# EasyEDA Pro project FPGC-CycloneIV-AIO.eprj, schematic Schematic1, sheet 4 of 4

## Sheets
4 IO: Create Date: 2025-10-29; Page Name: IO; Update Date: 2025-11-17
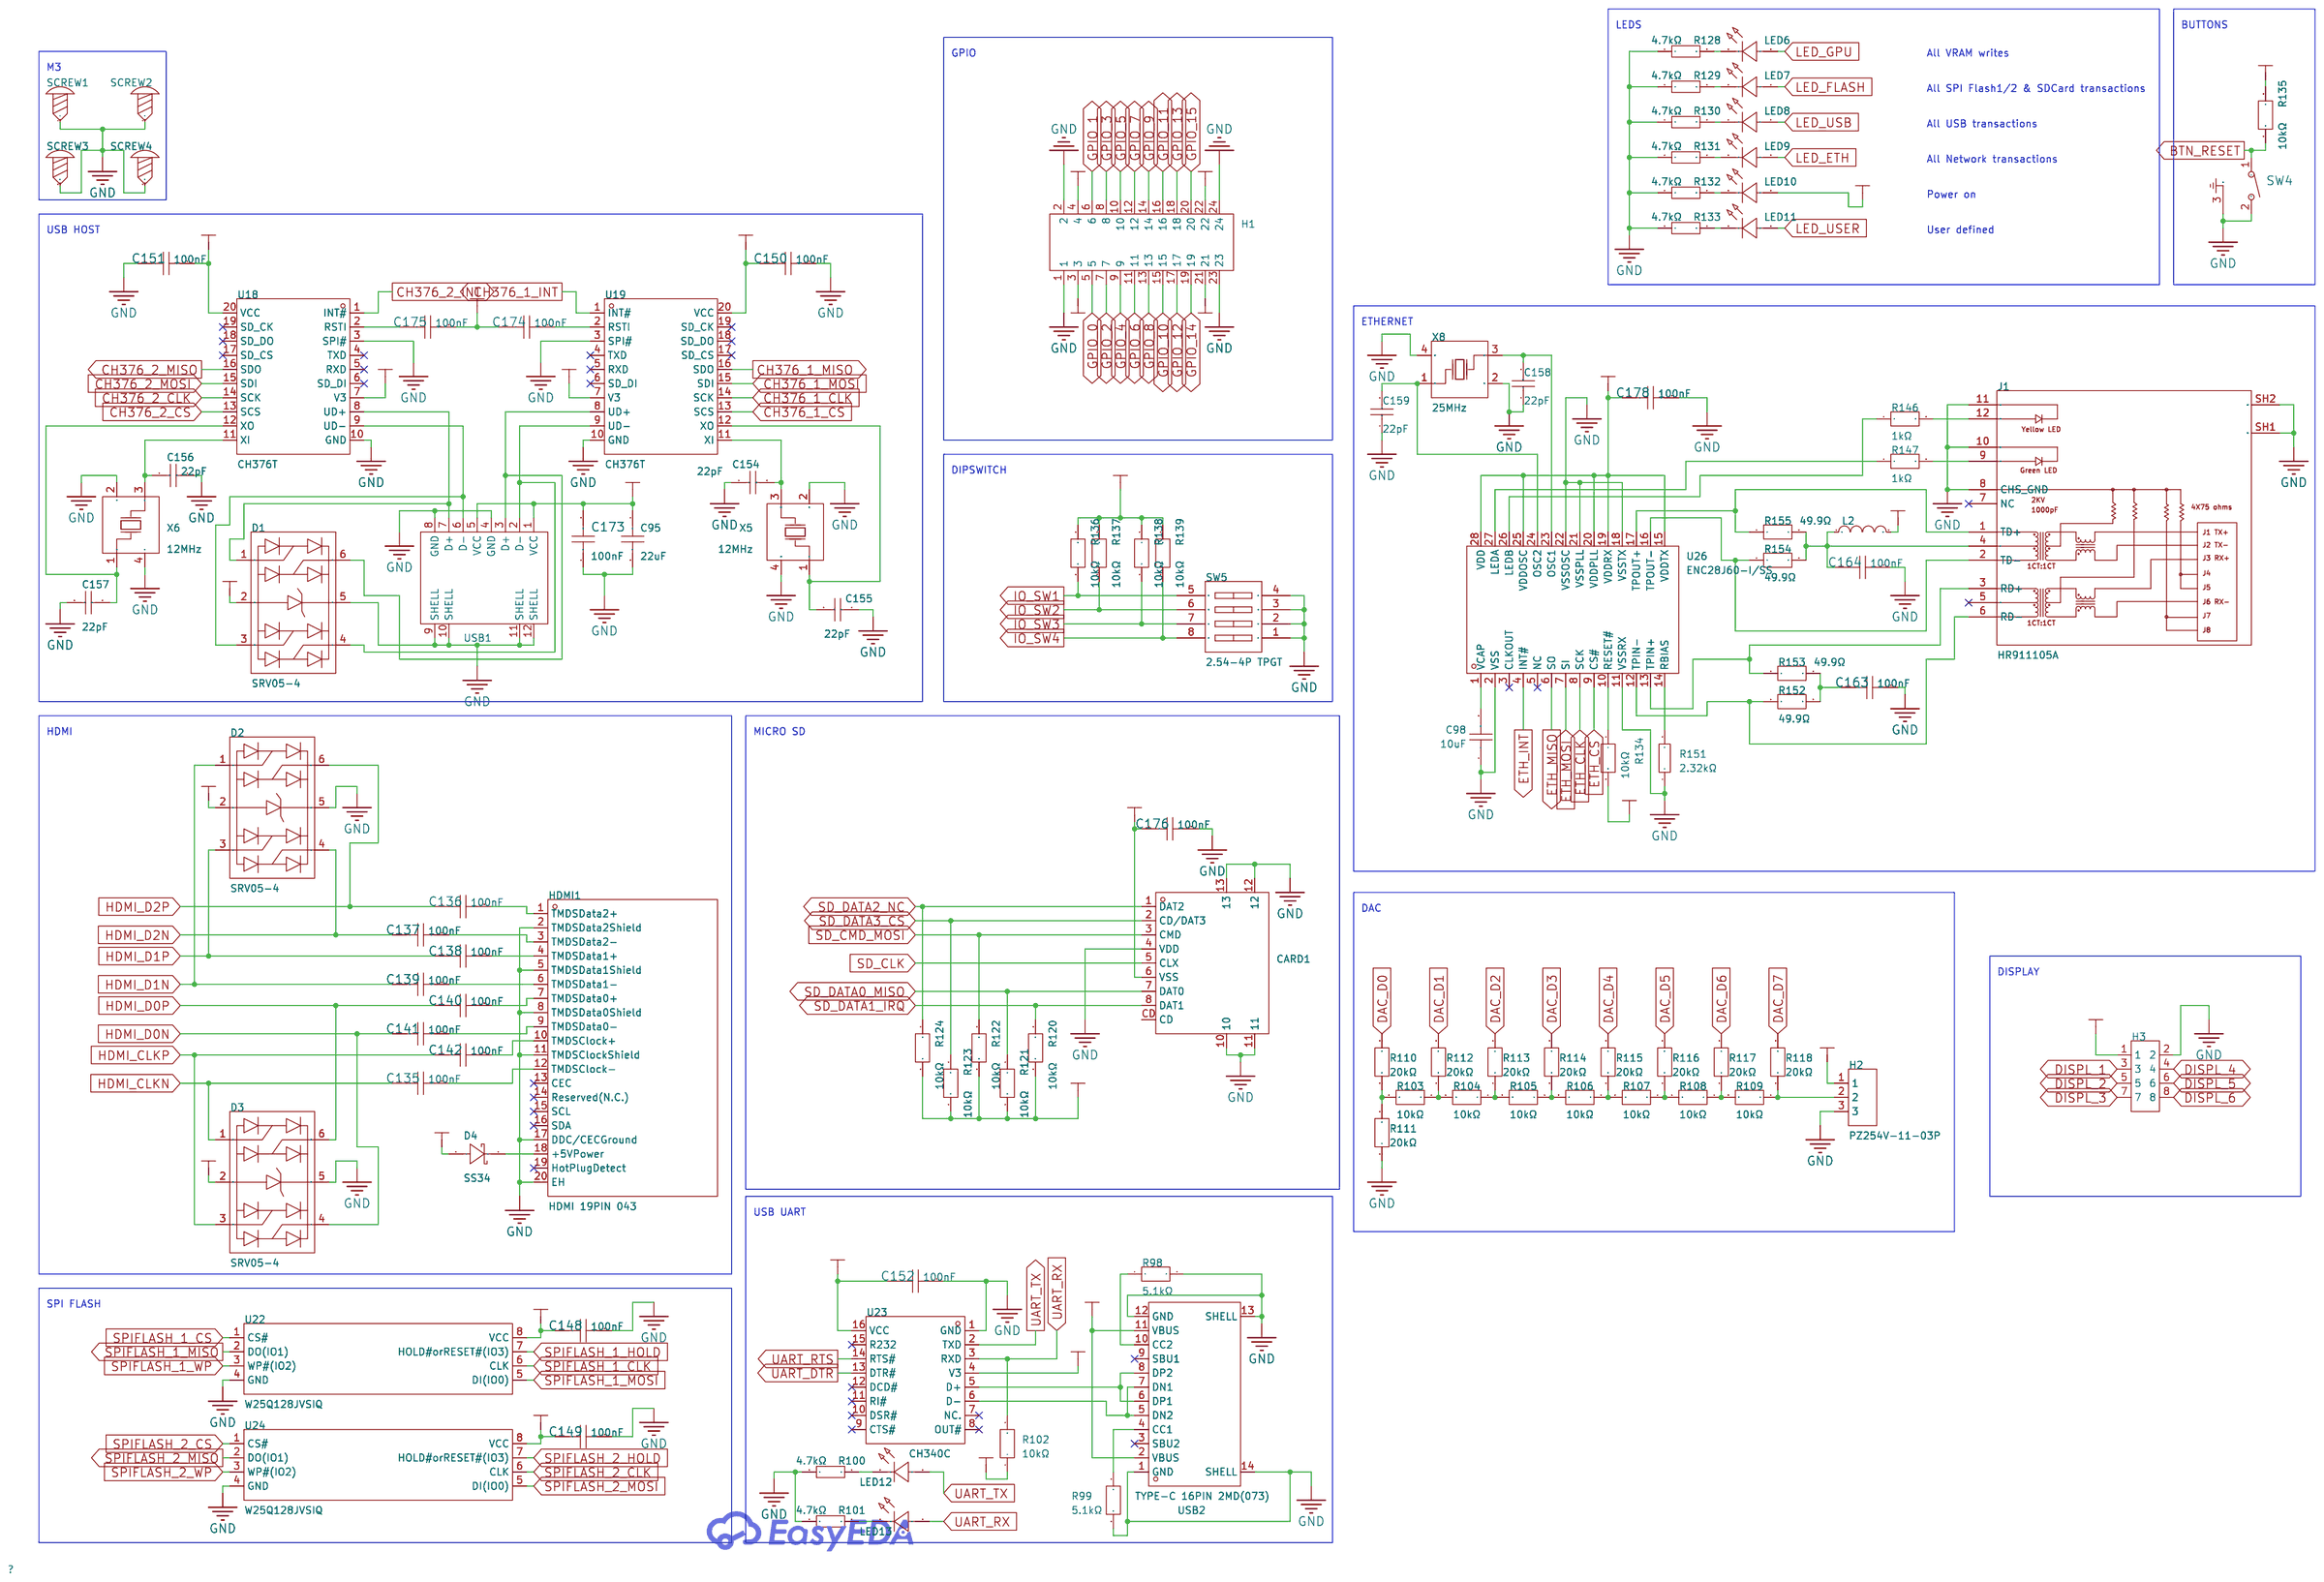
[diagram p3: IO]

## Parts
C95  22uF  [C0805]
C98  10uF  [C0805]
C135  100nF  [C0603]
C136  100nF  [C0603]
C137  100nF  [C0603]
C138  100nF  [C0603]
C139  100nF  [C0603]
C140  100nF  [C0603]
C141  100nF  [C0603]
C142  100nF  [C0603]
C148  100nF  [C0603]
C149  100nF  [C0603]
C150  100nF  [C0603]
C151  100nF  [C0603]
C152  100nF  [C0603]
C154  22pF  [C0603]
C155  22pF  [C0603]
C156  22pF  [C0603]
C157  22pF  [C0603]
C158  22pF  [C0603]
C159  22pF  [C0603]
C163  100nF  [C0603]
C164  100nF  [C0603]
C173  100nF  [C0603]
C174  100nF  [C0603]
C175  100nF  [C0603]
C176  100nF  [C0603]
C178  100nF  [C0603]
CARD1  TF PUSH  [TF-SMD_TF-PUSH]
D1  SRV05-4  [SOT-23-6_L2.9-W1.6-P0.95-LS2.8-BL]
D2  SRV05-4  [SOT-23-6_L2.9-W1.6-P0.95-LS2.8-BL]
D3  SRV05-4  [SOT-23-6_L2.9-W1.6-P0.95-LS2.8-BL]
D4  SS34  [SMA_L4.2-W2.7-LS5.0-RD]
H1  PZ254V-12-24P  [HDR-TH_24P-P2.54-V-M-R2-C12-S2.54]
H2  PZ254V-11-03P  [HDR-TH_3P-P2.54-V-M]
H3  PZ254V-12-8P  [HDR-TH_8P-P2.54-V-M-R2-C4-S2.54]
HDMI1  HDMI 19PIN 043  [HDMI-SMD_HDMI-19PIN-043]
J1  HR911105A  [RJ45-TH_HR911105A]
L2  BLM21PG221SN1D  [L0805]
LED6  XL-2012SURC  [LED0805-RD_RED]
LED7  XL-2012SURC  [LED0805-RD_RED]
LED8  XL-2012SURC  [LED0805-RD_RED]
LED9  XL-2012SURC  [LED0805-RD_RED]
LED10  XL-2012SURC  [LED0805-RD_RED]
LED11  XL-2012SURC  [LED0805-RD_RED]
LED12  XL-2012SURC  [LED0805-RD_RED]
LED13  XL-2012SURC  [LED0805-RD_RED]
R98  5.1kΩ  [R0603]
R99  5.1kΩ  [R0603]
R100  4.7kΩ  [R0603]
R101  4.7kΩ  [R0603]
R102  10kΩ  [R0603]
R103  10kΩ  [R0603]
R104  10kΩ  [R0603]
R105  10kΩ  [R0603]
R106  10kΩ  [R0603]
R107  10kΩ  [R0603]
R108  10kΩ  [R0603]
R109  10kΩ  [R0603]
R110  20kΩ  [R0603]
R111  20kΩ  [R0603]
R112  20kΩ  [R0603]
R113  20kΩ  [R0603]
R114  20kΩ  [R0603]
R115  20kΩ  [R0603]
R116  20kΩ  [R0603]
R117  20kΩ  [R0603]
R118  20kΩ  [R0603]
R120  10kΩ  [R0603]
R121  10kΩ  [R0603]
R122  10kΩ  [R0603]
R123  10kΩ  [R0603]
R124  10kΩ  [R0603]
R128  4.7kΩ  [R0603]
R129  4.7kΩ  [R0603]
R130  4.7kΩ  [R0603]
R131  4.7kΩ  [R0603]
R132  4.7kΩ  [R0603]
R133  4.7kΩ  [R0603]
R134  10kΩ  [R0603]
R135  10kΩ  [R0603]
R136  10kΩ  [R0603]
R137  10kΩ  [R0603]
R138  10kΩ  [R0603]
R139  10kΩ  [R0603]
R146  1kΩ  [R0603]
R147  1kΩ  [R0603]
R151  2.32kΩ  [R0603]
R152  49.9Ω  [R0603]
R153  49.9Ω  [R0603]
R154  49.9Ω  [R0603]
R155  49.9Ω  [R0603]
SCREW1  -  [Screw-Hole-M3]
SCREW2  -  [Screw-Hole-M3]
SCREW3  -  [Screw-Hole-M3]
SCREW4  -  [Screw-Hole-M3]
SW4  TS-1009B-05026  [SW-TH_3P-L4.5-W3.8-P3.10-LS1.9]
SW5  2.54-4P TPGT  [SW-SMD_8P-L10.2-W6.2-P2.54-LS9.4]
U18  CH376T  [SSOP-20_L7.5-W5.2-P0.65-LS8.0-BL]
U19  CH376T  [SSOP-20_L7.5-W5.2-P0.65-LS8.0-BL]
U22  W25Q128JVSIQ  [SOIC-8_L5.3-W5.3-P1.27-LS8.0-BL]
U23  CH340C  [SOP-16_L10.0-W3.9-P1.27-LS6.0-BL]
U24  W25Q128JVSIQ  [SOIC-8_L5.3-W5.3-P1.27-LS8.0-BL]
U26  ENC28J60-I/SS  [SSOP-28_L10.2-W5.3-P0.65-LS7.8-BL]
USB1  AF SS-JB17.6  [USB-A-TH_AF-SS-JB17.6]
USB2  TYPE-C 16PIN 2MD(073)  [USB-C-SMD_TYPE-C-6PIN-2MD-073]
X5  12MHz  [CRYSTAL-SMD_4P-L3.2-W2.5-BL]
X6  12MHz  [CRYSTAL-SMD_4P-L3.2-W2.5-BL]
X8  25MHz  [CRYSTAL-SMD_4P-L3.2-W2.5-BL-2]

## Library data of the parts
C95 = GRM21BZ71A226ME15L: LCSC Part Name: 22uF ±20% 10V; Supplier Part: C907991; Manufacturer: muRata(村田); Supplier Footprint: 0805; JLCPCB Part Class: Extended Part; Datasheet: https://atta.szlcsc.com/upload/public/pdf/source/20201022/C907991_FDD26F97C89A3C2FF3DDCDE25DF37A4B.pdf; Supplier: LCSC; Tolerance: ±20%
C98 = CL21A106KAYNNNE_C15850: LCSC Part Name: 10uF ±10% 25V; Supplier Part: C15850; Manufacturer: SAMSUNG(三星); Manufacturer Part: CL21A106KAYNNNE; Supplier Footprint: 0805; JLCPCB Part Class: Basic Part; Datasheet: https://item.szlcsc.com/datasheet/CL21A106KAYNNNE/16532.html; Supplier: LCSC; Tolerance: ±10%; Voltage Rating: 25V; Temperature Coefficient: X5R
C135-C142 C148-C152 C163 C164 C173-C176 C178 = CL10B104KB8NNNC: LCSC Part Name: 100nF ±10% 50V; Supplier Part: C1591; Manufacturer: SAMSUNG(三星); Supplier Footprint: 0603; JLCPCB Part Class: Extended Part; Datasheet: https://item.szlcsc.com/datasheet/CL10B104KB8NNNC/1943.html; Supplier: LCSC; Tolerance: ±10%; Voltage Rating: 50V; Temperature Coefficient: X7R
C154-C159 = CL10C220JB8NNNC: LCSC Part Name: 22pF ±5% 50V; Supplier Part: C1653; Manufacturer: SAMSUNG(三星); Supplier Footprint: 0603; JLCPCB Part Class: Basic Part; Datasheet: https://item.szlcsc.com/datasheet/CL10C220JB8NNNC/2005.html; Supplier: LCSC; Tolerance: ±5%; Voltage Rating: 50V; Temperature Coefficient: C0G
CARD1 = TF PUSH: LCSC Part Name: 自弹式 MicroSD卡(TF卡) 卡座; Supplier Part: C393941; Manufacturer: SHOU HAN(首韩); Supplier Footprint: SMD; JLCPCB Part Class: Extended Part; Datasheet: https://item.szlcsc.com/datasheet/TF%2520PUSH/372553.html; Supplier: LCSC; Card Connection Mode: Push-Push; Card Type: MicroSD Card (TF Card); Connector Type: Connector and Ejector; Additional Card Detection Pins: No; Height Above Board: 2mm; Operating Temperature: -25℃~+90℃
D1-D3 = SRV05-4_C558418: LCSC Part Name: ESD，可防25kV静电; Supplier Part: C558418; Manufacturer: TECH PUBLIC(台舟); Supplier Footprint: SOT-23-6; JLCPCB Part Class: Extended Part; Datasheet: https://item.szlcsc.com/datasheet/SRV05-4/581825.html; Supplier: LCSC; Polarity: Unidirectional; Reverse Stand-Off Voltage (Vrwm): 5V; Clamping Voltage: 20V; Peak Pulse Current (Ipp): 3A; Peak Pulse Power Dissipation (Ppp): 60W; Voltage - Breakdown: 6V; Reverse Leakage Current (Ir): 500nA; Number of Channels: 4; Operating Temperature: -55℃~+125℃; level of protection: IEC 61000-4-2；IEC 61000-4-4；IEC 61000-4-5; Type: ESD; Junction Capacitance: 0.8pF；0.3pF
D4 = SS34_C2837271: LCSC Part Name: 电压:40V 电流:3A; Supplier Part: C2837271; Manufacturer: JSMSEMI(杰盛微); Supplier Footprint: SMA(DO-214AC); JLCPCB Part Class: Extended Part; Datasheet: https://item.szlcsc.com/datasheet/SS34/3007843.html; Supplier: LCSC; Voltage - Forward(Vf@If): 550mV@3A; Voltage - DC Reverse(Vr): 40V; Current - Rectified: 3A
H1 = PZ254V-12-24P: LCSC Part Name: 2x12P 间距:2.54mm 方针 直插; Supplier Part: C492429; Manufacturer: XFCN(兴飞); Supplier Footprint: 插件,P=2.54mm; JLCPCB Part Class: Extended Part; Datasheet: https://item.szlcsc.com/datasheet/PZ254V-12-24P/502985.html; Supplier: LCSC; Pin Structure: 2x12P; Pitch: 2.54mm; Row Spacing: 2.54mm; Circluar Pins/Square Pins: Pin Header; Mounting Type: Through Hole; Number of Rows: 2; Number of Pins: 24P; Length of Mating Pin: 6mm; Insulation Height: 2.5mm; Length of End Connection Pin: 3mm; Contact Material: Brass; Operating Temperature: -40℃~+105℃; Color: Black
H2 = PZ254V-11-03P: LCSC Part Name: 1x3P 间距:2.54mm 方针 直插; Supplier Part: C2937625; Manufacturer: XFCN(兴飞); Supplier Footprint: 插件,P=2.54mm; JLCPCB Part Class: Extended Part; Datasheet: https://item.szlcsc.com/datasheet/PZ254V-11-03P/3293280.html; Supplier: LCSC; Pin Structure: 1x3P; Pitch: 2.54mm; Circluar Pins/Square Pins: Pin Header; Mounting Type: Through Hole; Number of Rows: 1; Number of Pins: 3P; Current Rating: 3A; Voltage Rating (Max): 250V; Length of Mating Pin: 6mm; Insulation Height: 2.5mm; Length of End Connection Pin: 3mm; Operating Temperature: -40℃~+105℃; Color: Black
H3 = PZ254V-12-8P: LCSC Part Name: 2x4P 间距:2.54mm 方针 直插; Supplier Part: C492421; Manufacturer: XFCN(兴飞); Supplier Footprint: 插件,P=2.54mm; JLCPCB Part Class: Extended Part; Datasheet: https://item.szlcsc.com/datasheet/PZ254V-12-8P/502977.html; Supplier: LCSC; Pin Structure: 2x4P; Pitch: 2.54mm; Row Spacing: 2.54mm; Circluar Pins/Square Pins: Pin Header; Mounting Type: Through Hole; Number of Rows: 2; Number of Pins: 8P; Length of Mating Pin: 6mm; Insulation Height: 2.5mm; Length of End Connection Pin: 3mm; Contact Material: Brass; Operating Temperature: -40℃~+105℃; Color: Black
HDMI1 = HDMI 19PIN 043: Supplier Part: C2858275; Manufacturer: SHOU HAN(首韩); Supplier Footprint: SMD; JLCPCB Part Class: Extended Part; Datasheet: https://item.szlcsc.com/datasheet/HDMI%252019PIN%2520043/3059425.html; Supplier: LCSC; Connector Type: HDMI-A; Gender: Female; Number of Pins: 19P; Mounting Type: Surface Mount, Right Angle; Current Rating: 300mA; Voltage Rating: 40V; Operating Temperature: -55℃~+85℃
J1 = HR911105A_C12074: LCSC Part Name: 带LED; Supplier Part: C12074; Manufacturer: HANRUN(汉仁); Supplier Footprint: 插件; JLCPCB Part Class: Extended Part; Datasheet: https://item.szlcsc.com/datasheet/HR911105A/12651.html; Supplier: LCSC; Connector Type: RJ45 Jack; Number of Ports: 1; LED: With LED; PoE: Non-PoE; Supplementary Features: Filtered
L2 = BLM21PG221SN1D: LCSC Part Name: 单路 0805磁珠 阻抗220Ω@100MHz; Supplier Part: C85840; Manufacturer: muRata(村田); Supplier Footprint: 0805; JLCPCB Part Class: Extended Part; Datasheet: https://atta.szlcsc.com/upload/public/pdf/source/20180326/C118443_3FAC30E9A4F0E6B81275543C61E0685E.pdf; Supplier: LCSC; Impedance @ Frequency: 220Ω@100MHz; Tolerance: ±25%; DC Resistance: 45mΩ; Current Rating: 2A; Circuits: 1
LED6-LED13 = XL-2012SURC: Supplier Part: C965812; Manufacturer: XINGLIGHT(成兴光); Supplier Footprint: 0805; JLCPCB Part Class: Extended Part; Datasheet: https://atta.szlcsc.com/upload/public/pdf/source/20221102/49E1A0A365644091E6270AF1C5E0FE37.pdf; Supplier: LCSC; Emitted Color: Red; Power Dissipation: 55mW; Forward Current: 25mA; Dominant Wavelength: 617nm~621nm; Peak Wavelength: 623nm; Lens Color: 无色透明透镜; Viewing Angle: 120°; Mounting Sytle: Positive post; Operating Temperature: -30℃~+85℃
R98 R99 = FRC0603F5101TS: LCSC Part Name: 5.1kΩ ±1% 100mW 厚膜电阻; Supplier Part: C2907044; Manufacturer: FOJAN(富捷); Supplier Footprint: 0603; JLCPCB Part Class: Extended Part; Supplier: LCSC; Type: Thick Film Resistor; Tolerance: ±1%; Power(Watts): 100mW; Voltage-Supply(Max): 75V; Temperature Coefficient: ±100ppm/℃; Operating Temperature: -55℃~+155℃
R100 R101 R128-R133 = RC0603FR-074K7L: LCSC Part Name: 厚膜电阻 4.7kΩ ±1% 100mW; Supplier Part: C99782; Manufacturer: YAGEO(国巨); Supplier Footprint: 0603; JLCPCB Part Class: Extended Part; Datasheet: https://item.szlcsc.com/datasheet/RC0603FR-074K7L/100996.html; Supplier: LCSC; Type: Thick Film Resistor; Tolerance: ±1%; Power(Watts): 100mW; Voltage-Supply(Max): 75V; Temperature Coefficient: ±100ppm/℃; Operating Temperature: -55℃~+155℃
R102-R109 R120-R124 R134-R139 = FRC0603F1002TS: LCSC Part Name: 10kΩ ±1% 100mW 厚膜电阻; Supplier Part: C2906982; Manufacturer: FOJAN(富捷); Supplier Footprint: 0603; JLCPCB Part Class: Extended Part; Supplier: LCSC; Type: Thick Film Resistor; Tolerance: ±1%; Power(Watts): 100mW; Voltage-Supply(Max): 75V; Temperature Coefficient: ±100ppm/℃; Operating Temperature: -55℃~+155℃
R110-R118 = FRC0603F2002TS: LCSC Part Name: 20kΩ ±1% 100mW 厚膜电阻; Supplier Part: C2907011; Manufacturer: FOJAN(富捷); Supplier Footprint: 0603; JLCPCB Part Class: Extended Part; Supplier: LCSC; Type: Thick Film Resistor; Tolerance: ±1%; Power(Watts): 100mW; Voltage-Supply(Max): 75V; Temperature Coefficient: ±100ppm/℃; Operating Temperature: -55℃~+155℃
R146 R147 = FRC0603F1001TS: LCSC Part Name: 1kΩ ±1% 100mW 厚膜电阻; Supplier Part: C2907002; Manufacturer: FOJAN(富捷); Supplier Footprint: 0603; JLCPCB Part Class: Extended Part; Supplier: LCSC; Type: Thick Film Resistor; Tolerance: ±1%; Power(Watts): 100mW; Voltage-Supply(Max): 75V; Temperature Coefficient: ±100ppm/℃; Operating Temperature: -55℃~+155℃
R151 = RC0603FR-072K32L: LCSC Part Name: 厚膜电阻 2.32kΩ ±1% 100mW; Supplier Part: C137749; Manufacturer: YAGEO(国巨); Supplier Footprint: 0603; JLCPCB Part Class: Extended Part; Datasheet: https://atta.szlcsc.com/upload/public/pdf/source/20180821/C275644_0D56F95EFF785E7D9A1FEF436B37DA78.pdf; Supplier: LCSC; Type: Thick Film Resistors; Tolerance: ±1%; Temperature Coefficient: ±100ppm/℃; Operating Temperature Range: -55℃~+155℃
R152-R155 = FRC0603F49R9TS: LCSC Part Name: 49.9Ω ±1% 100mW 厚膜电阻; Supplier Part: C2930110; Manufacturer: FOJAN(富捷); Supplier Footprint: 0603; JLCPCB Part Class: Extended Part; Supplier: LCSC; Type: Thick Film Resistor; Tolerance: ±1%; Power(Watts): 100mW; Voltage-Supply(Max): 75V; Temperature Coefficient: ±100ppm/℃; Operating Temperature: -55℃~+155℃
SCREW1-SCREW4 = Screw-Hole-M3: Supplier Footprint: 插件
SW4 = TS-1009B-05026: LCSC Part Name: 4.5*4.5*5mm 卧插 轻触开关; Supplier Part: C455252; Manufacturer: XUNPU(讯普); Supplier Footprint: 插件,4.5x4.5mm; JLCPCB Part Class: Extended Part; Datasheet: https://item.szlcsc.com/datasheet/TS-1009B-05026/457607.html; Supplier: LCSC; Circuit: SPST; Actuator Style: Round Button; Mounting Type: Right Angle; Length: 4.5mm; Width: 4.5mm; Switch Height: 5mm; Contact Current: 50mA; Voltage Rating: 12V
SW5 = 2.54-4P TPGT: LCSC Part Name: 间距2.54mm 4位高推 拨码开关 贴片; Supplier Part: C6331176; Manufacturer: SHOU HAN(首韩); Supplier Footprint: SMD; JLCPCB Part Class: Extended Part; Datasheet: https://item.szlcsc.com/datasheet/2.54-4P%2520TPGT/7279369.html; Supplier: LCSC; Type: Slide, Rocked; Circuit: SPST; Number of Positions: 4; Termination Style: Gull Wing; Lead Pitch: 2.54mm; Current Rating: 25mA; Voltage Rating: 24V; Operating Temperature: -30℃~+85℃; Operating Life: 2,000 Cycles; Color: Black
U18 U19 = CH376T: LCSC Part Name: U盘和SD卡文件管理控制芯片CH376; Supplier Part: C21282; Manufacturer: WCH(南京沁恒); Supplier Footprint: SSOP-20-208mil; JLCPCB Part Class: Extended Part; Datasheet: https://atta.szlcsc.com/upload/public/pdf/source/20240313/60C8C68E889EBFB727F2D0ECB415D21E.pdf; Supplier: LCSC; Applications Function: USB to SPI；USB to UART; Supply Voltage: 5V；3.3V; Data Rate: 12Mbps; Operating Temperature: -40℃~+85℃
U22 U24 = W25Q128JVSIQ_C113767: LCSC Part Name: 支持双路/四路SPI接口的3V、128Mbit 串行闪存; Supplier Part: C113767; Manufacturer: Winbond(华邦); Supplier Footprint: SOIC-8-208mil; JLCPCB Part Class: Extended Part; Datasheet: https://item.szlcsc.com/datasheet/W25Q128JVSIQ/115003.html; Supplier: LCSC; Interface: SPI; Clock Frequency: 133MHz; Voltage - Supply: 2.7V~3.6V; Program / Erase Cycles: 100,000 Cycles; Page Programming Time (Tpp): 3ms
U23 = CH340C: LCSC Part Name: USB转串口芯片; Supplier Part: C84681; Manufacturer: WCH(南京沁恒); Supplier Footprint: SOP-16; JLCPCB Part Class: Extended Part; Datasheet: https://item.szlcsc.com/datasheet/CH340C/85852.html; Supplier: LCSC; Applications Function: Transceiver; USB Protocol: USB 2.0; Voltage - Supply: 3.3V；5V; Data Rate: 2Mbps; Operating Temperature: -20℃~+70℃; Current - Supply: 7mA; Supply Current (Iq): 50uA
U26 = ENC28J60-I/SS: LCSC Part Name: 独立以太网控制器，带SPI接口; Supplier Part: C411626; Manufacturer: MICROCHIP(美国微芯); Supplier Footprint: SSOP-28-208mil; JLCPCB Part Class: Extended Part; Datasheet: https://item.szlcsc.com/datasheet/ENC28J60-I%252FSS/403163.html; Supplier: LCSC; Number of Channels: 1; Interface: SPI; Voltage - Supply: 3.3V; Operating Temperature: -40℃~+85℃
USB1 = AF SS-JB17.6: LCSC Part Name: Type-A 母 弯插; Supplier Part: C456021; Manufacturer: SHOU HAN(首韩); Supplier Footprint: 弯插; JLCPCB Part Class: Extended Part; Datasheet: https://item.szlcsc.com/datasheet/AF%2520SS-JB17.6/458828.html; Supplier: LCSC; Connector Type: Type-A; Protocol Standard: USB 2.0; Gender: Female; Mounting Type: Right Angle; Number of Contacts: 4Px2; Number of Ports: 2; Current Rating-Power: 1.5A; Voltage Rating: 30V; Connect-Disconnect Life: 5,000 Cycles; Length: 17.6mm; Detection color: White; Operating Temperature: -25℃~+85℃
USB2 = TYPE-C 16PIN 2MD(073): LCSC Part Name: Type-C 母 卧贴; Supplier Part: C2765186; Manufacturer: SHOU HAN(首韩); Supplier Footprint: SMD; JLCPCB Part Class: Extended Part; Datasheet: https://item.szlcsc.com/datasheet/TYPE-C%252016PIN%25202MD(073)/2901843.html; Supplier: LCSC; Connector Type: Type-C; Gender: Female; Mounting Type: Surface Mount, Right Angle; Number of Contacts: 16P; Number of Ports: 1; Current Rating-Power: 3A; Voltage Rating: 5V; Connect-Disconnect Life: 5,000 Cycles; Detection color: Black; Operating Temperature: -25℃~+85℃
X5 X6 = X322512MSB4SI: LCSC Part Name: YSX321SL 12MHZ 4P 3225 20PF ±10PPM -40~85℃ (±20PPM); Supplier Part: C9002; Manufacturer: YXC(扬兴晶振); Supplier Footprint: SMD3225-4P; JLCPCB Part Class: Basic Part; Datasheet: https://item.szlcsc.com/datasheet/X322512MSB4SI/9522.html; Supplier: LCSC; Type: Surface Mount Crystal; Normal temperature Frequency Tolerance: ±10ppm; Load Capacitance: 20pF; Frequency Stability: ±20ppm; Operating Temperature: -40℃~+85℃
X8 = X322525MSB4SI: LCSC Part Name: YSX321SL 25MHZ 4P 3225 20PF ±10PPM -40~85℃ (±20PPM); Supplier Part: C13740; Manufacturer: YXC(扬兴晶振); Supplier Footprint: SMD3225-4P; JLCPCB Part Class: Extended Part; Datasheet: https://item.szlcsc.com/datasheet/X322525MSB4SI/14395.html; Supplier: LCSC; Type: Crystal Oscillator; Normal temperature Frequency Tolerance: ±10ppm; Load Capacitance: 20pF; Frequency Stability: ±20ppm; Operating Temperature: -40℃~+85℃

## Nets
3V3: C148.1 C149.1 C150.1 C151.2 C152.1 C174.1 C175.2 C176.1 C178.1 CARD1.6(VSS) D2.2 D3.2 H1.3 H1.4 H2.1 H3.1 L2.2 LED10.2(A) R102.1 R120.2 R121.2 R122.2 R123.2 R124.2 R134.2 R135.1 R136.1 R137.1 R138.1 R139.1 U18.7(V3) U18.20(VCC) U19.7(V3) U19.20(VCC) U22.8(VCC) U23.4(V3) U23.16(VCC) U24.8(VCC) U26.15(VDDTX) U26.19(VDDRX) U26.20(VDDPLL) U26.25(VDDOSC) U26.28(VDD) ; also on sheet 1 2 3
5V: C95.1 C173.2 D1.2 D4.2(A) H1.21 H1.22 USB1.1(VCC) USB1.5(VCC) ; also on sheet 2
GND: C95.2 C98.1 C148.2 C149.2 C150.2 C151.1 C152.2 C154.1 C155.1 C156.1 C157.1 C158.1 C159.1 C163.2 C164.2 C173.1 C176.2 C178.2 CARD1.4(VDD) CARD1.10 CARD1.11 CARD1.12 CARD1.13 D1.5 D2.5 D3.5 H1.1 H1.2 H1.23 H1.24 H2.3 H3.2 HDMI1.2(TMDSData2Shield) HDMI1.5(TMDSData1Shield) HDMI1.8(TMDSData0Shield) HDMI1.11(TMDSClockShield) HDMI1.17(DDC/CECGround) HDMI1.20(EH) J1.8(CHS GND) J1.10 J1.11 J1.SH1 J1.SH2 R98.2 R99.2 R100.1 R101.1 R111.1 R128.1 R129.1 R130.1 R131.1 R132.1 R133.1 R151.1 SCREW1.1 SCREW2.1 SCREW3.1 SCREW4.1 SW4.2 SW4.3 SW5.1(A1) SW5.2(A2) SW5.3(A3) SW5.4(A4) U18.3(SPI#) U18.10(GND) U19.3(SPI#) U19.10(GND) U22.4(GND) U23.1(GND) U24.4(GND) U26.2(VSS) U26.11(VSSRX) U26.18(VSSTX) U26.21(VSSPLL) U26.22(VSSOSC) USB1.4(GND) USB1.8(GND) USB1.9(SHELL) USB1.10(SHELL) USB1.11(SHELL) USB1.12(SHELL) USB2.1(GND) USB2.12(GND) USB2.13(SHELL) USB2.14(SHELL) X5.2(GND) X5.4(GND) X6.2(GND) X6.4(GND) X8.2(GND) X8.4(GND) ; also on sheet 1 2 3
BTN_RESET: R135.2 SW4.1 ; also on sheet 1
CH376_1_CLK: U19.14(SCK) ; also on sheet 1
CH376_1_CS: U19.13(SCS) ; also on sheet 1
CH376_1_INT: U19.1(INT#) ; also on sheet 1
CH376_1_MISO: U19.16(SDO) ; also on sheet 1
CH376_1_MOSI: U19.15(SDI) ; also on sheet 1
CH376_2_CLK: U18.14(SCK) ; also on sheet 1
CH376_2_CS: U18.13(SCS) ; also on sheet 1
CH376_2_INT: U18.1(INT#) ; also on sheet 1
CH376_2_MISO: U18.16(SDO) ; also on sheet 1
CH376_2_MOSI: U18.15(SDI) ; also on sheet 1
DAC_D0: R110.2 ; also on sheet 1
DAC_D1: R112.2 ; also on sheet 1
DAC_D2: R113.2 ; also on sheet 1
DAC_D3: R114.2 ; also on sheet 1
DAC_D4: R115.2 ; also on sheet 1
DAC_D5: R116.2 ; also on sheet 1
DAC_D6: R117.2 ; also on sheet 1
DAC_D7: R118.2 ; also on sheet 1
DISPL_1: H3.3
DISPL_2: H3.5
DISPL_3: H3.7
DISPL_4: H3.4
DISPL_5: H3.6
DISPL_6: H3.8
ETH_CLK: U26.8(SCK) ; also on sheet 1
ETH_CS: U26.9(CS#) ; also on sheet 1
ETH_INT: U26.4(INT#) ; also on sheet 1
ETH_MISO: U26.6(SO) ; also on sheet 1
ETH_MOSI: U26.7(SI) ; also on sheet 1
GPIO_0: H1.5
GPIO_1: H1.6
GPIO_2: H1.7
GPIO_3: H1.8
GPIO_4: H1.9
GPIO_5: H1.10
GPIO_6: H1.11
GPIO_7: H1.12
GPIO_8: H1.13
GPIO_9: H1.14
GPIO_10: H1.15
GPIO_11: H1.16
GPIO_12: H1.17
GPIO_13: H1.18
GPIO_14: H1.19
GPIO_15: H1.20
HDMI_CLKN: C135.1 D3.1 ; also on sheet 1
HDMI_CLKP: C142.1 D3.3 ; also on sheet 1
HDMI_D0N: C141.1 D3.4 ; also on sheet 1
HDMI_D0P: C140.1 D3.6 ; also on sheet 1
HDMI_D1N: C139.1 D2.1 ; also on sheet 1
HDMI_D1P: C138.1 D2.3 ; also on sheet 1
HDMI_D2N: C137.1 D2.4 ; also on sheet 1
HDMI_D2P: C136.1 D2.6 ; also on sheet 1
IO_SW1: R136.2 SW5.5(B4) ; also on sheet 1
IO_SW2: R137.2 SW5.6(B3) ; also on sheet 1
IO_SW3: R138.2 SW5.7(B2) ; also on sheet 1
IO_SW4: R139.2 SW5.8(B1) ; also on sheet 1
LED_ETH: LED9.2(A) ; also on sheet 1
LED_FLASH: LED7.2(A) ; also on sheet 1
LED_GPU: LED6.2(A) ; also on sheet 1
LED_USB: LED8.2(A) ; also on sheet 1
LED_USER: LED11.2(A) ; also on sheet 1
SD_CLK: CARD1.5(CLX) ; also on sheet 1
SD_CMD_MOSI: CARD1.3(CMD) R122.1 ; also on sheet 1
SD_DATA0_MISO: CARD1.7(DAT0) R121.1 ; also on sheet 1
SD_DATA1_IRQ: CARD1.8(DAT1) R120.1 ; also on sheet 1
SD_DATA2_NC: CARD1.1(DAT2) R124.1 ; also on sheet 1
SD_DATA3_CS: CARD1.2(CD/DAT3) R123.1 ; also on sheet 1
SPIFLASH_1_CLK: U22.6(CLK) ; also on sheet 1
SPIFLASH_1_CS: U22.1(CS#) ; also on sheet 1
SPIFLASH_1_HOLD: U22.7(HOLD#orRESET#(IO3)) ; also on sheet 1
SPIFLASH_1_MISO: U22.2(DO(IO1)) ; also on sheet 1
SPIFLASH_1_MOSI: U22.5(DI(IO0)) ; also on sheet 1
SPIFLASH_1_WP: U22.3(WP#(IO2)) ; also on sheet 1
SPIFLASH_2_CLK: U24.6(CLK) ; also on sheet 1
SPIFLASH_2_CS: U24.1(CS#) ; also on sheet 1
SPIFLASH_2_HOLD: U24.7(HOLD#orRESET#(IO3)) ; also on sheet 1
SPIFLASH_2_MISO: U24.2(DO(IO1)) ; also on sheet 1
SPIFLASH_2_MOSI: U24.5(DI(IO0)) ; also on sheet 1
SPIFLASH_2_WP: U24.3(WP#(IO2)) ; also on sheet 1
UART_DTR: U23.13(DTR#) ; also on sheet 1
UART_RTS: U23.14(RTS#) ; also on sheet 1
UART_RX: LED13.2(A) R102.2 U23.3(RXD) ; also on sheet 1
UART_TX: LED12.2(A) U23.2(TXD) ; also on sheet 1
VUSB: USB2.2(VBUS) USB2.11(VBUS) ; also on sheet 2
$6N4559: D4.1(K) HDMI1.18(+5VPower)
$6N4594: C136.2 HDMI1.1(TMDSData2+)
$6N4598: C137.2 HDMI1.3(TMDSData2-)
$6N4605: C138.2 HDMI1.4(TMDSData1+)
$6N4610: C139.2 HDMI1.6(TMDSData1-)
$6N4615: C140.2 HDMI1.7(TMDSData0+)
$6N4622: C141.2 HDMI1.9(TMDSData0-)
$6N4639: C142.2 HDMI1.10(TMDSClock+)
$6N4646: C135.2 HDMI1.12(TMDSClock-)
$6N5787: C174.2 U19.2(RSTI)
$6N7003: D1.1 U18.8(UD+) USB1.7(D+)
$6N7006: D1.3 U18.9(UD-) USB1.6(D-)
$6N7047: C175.1 U18.2(RSTI)
$6N11145: U23.6(D-) USB2.5(DN2) USB2.7(DN1)
$6N11151: U23.5(D+) USB2.6(DP1) USB2.8(DP2)
$6N11184: R98.1 USB2.10(CC2)
$6N11276: R99.1 USB2.4(CC1)
$6N12091: C159.2 U26.24(OSC2) X8.1(OSC1)
$6N12099: C158.2 U26.23(OSC1) X8.3(OSC2)
$6N12604: C164.1 J1.4 L2.1 R154.2 R155.2
$6N12665: J1.1(TD+) R155.1 U26.17(TPOUT+)
$6N12673: J1.2(TD-) R154.1 U26.16(TPOUT-)
$6N12703: J1.3(RD+) R153.1 U26.13(TPIN+)
$6N12731: J1.6(RD-) R152.1 U26.12(TPIN-)
$6N12749: C163.1 R152.2 R153.2
$6N12885: J1.12 R146.2
$6N12889: J1.9 R147.2
$6N13116: C98.2 U26.1(VCAP)
$6N13120: R151.2 U26.14(RBIAS)
$6N13295: R147.1 U26.27(LEDA)
$6N13302: R146.1 U26.26(LEDB)
$6N13561: R134.1 U26.10(RESET#)
$6N17374: R103.1 R104.2 R112.1
$6N17413: R104.1 R105.2 R113.1
$6N17452: R105.1 R106.2 R114.1
$6N17491: R106.1 R107.2 R115.1
$6N17530: R107.1 R108.2 R116.1
$6N17569: R108.1 R109.2 R117.1
$6N17573: R103.2 R110.1 R111.2
$6N17586: H2.2 R109.1 R118.1
$6N35704: LED12.1(K) R100.2
$6N35748: LED13.1(K) R101.2
$6N35876: LED6.1(K) R128.2
$6N35972: LED7.1(K) R129.2
$6N36071: LED8.1(K) R130.2
$6N36172: LED9.1(K) R131.2
$6N36275: LED10.1(K) R132.2
$6N36380: LED11.1(K) R133.2
$6N83418: C154.2 U19.11(XI) X5.3(OSC2)
$6N83423: C155.2 U19.12(XO) X5.1(OSC1)
$6N83631: C157.2 U18.12(XO) X6.1(OSC1)
$6N83649: C156.2 U18.11(XI) X6.3(OSC2)
$6N102280: D1.6 U19.8(UD+) USB1.3(D+)
$6N102284: D1.4 U19.9(UD-) USB1.2(D-)

Not connected (* = marked no-connect by the designer): CARD1 CD; HDMI1 13(CEC)* 14(Reserved(N.C.))* 15(SCL)* 16(SDA)* 19(HotPlugDetect)*; J1 5* 7(NC)*; U18 4(TXD)* 5(RXD)* 6(SD_DI)* 17(SD_CS)* 18(SD_DO)* 19(SD_CK)*; U19 4(TXD)* 5(RXD)* 6(SD_DI)* 17(SD_CS)* 18(SD_DO)* 19(SD_CK)*; U23 7(NC.)* 8(OUT#)* 9(CTS#)* 10(DSR#)* 11(RI#)* 12(DCD#)* 15(R232)*; U26 3(CLKOUT)* 5(NC)*; USB2 3(SBU2)* 9(SBU1)*

## Notes on the sheets
sheet 4
- LEDS
- BUTTONS
- GPIO
- All VRAM writes
- M3
- All SPI Flash1/2 & SDCard transactions
- All USB transactions
- All Network transactions
- Power on
- USB HOST
- User defined
- ETHERNET
- DIPSWITCH
- HDMI
- MICRO SD
- DAC
- DISPLAY
- USB UART
- SPI FLASH
